# EAGLE schematic snowflake-hw-v1.0.1 R5 (EAGLE 9.2.2)
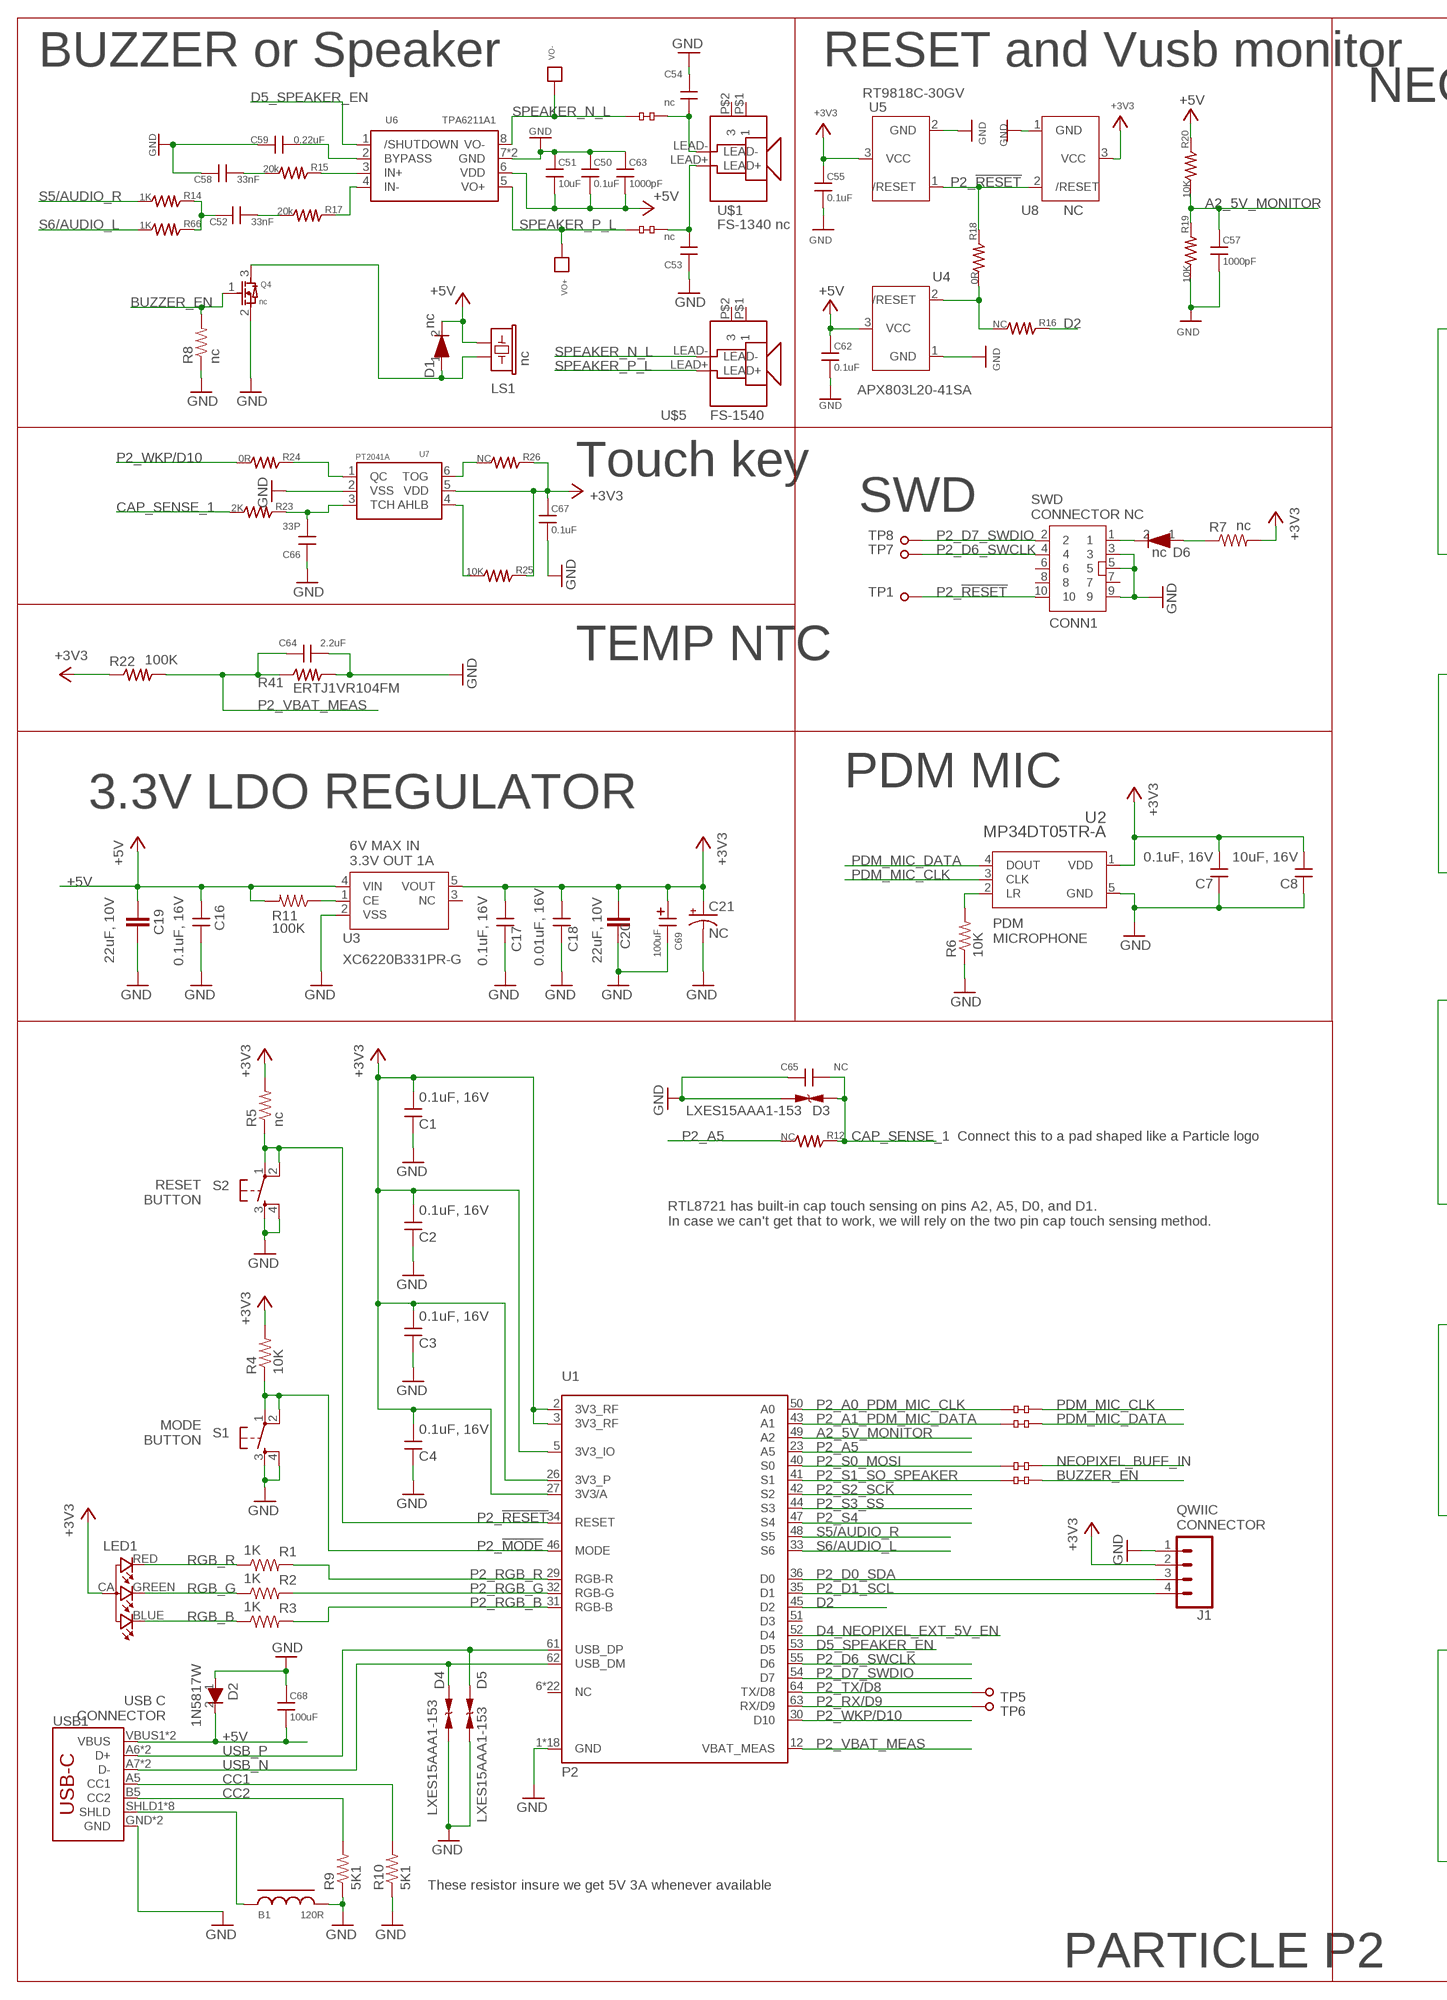
[diagram p0: schematic, sheet 1, part 1 of 2]
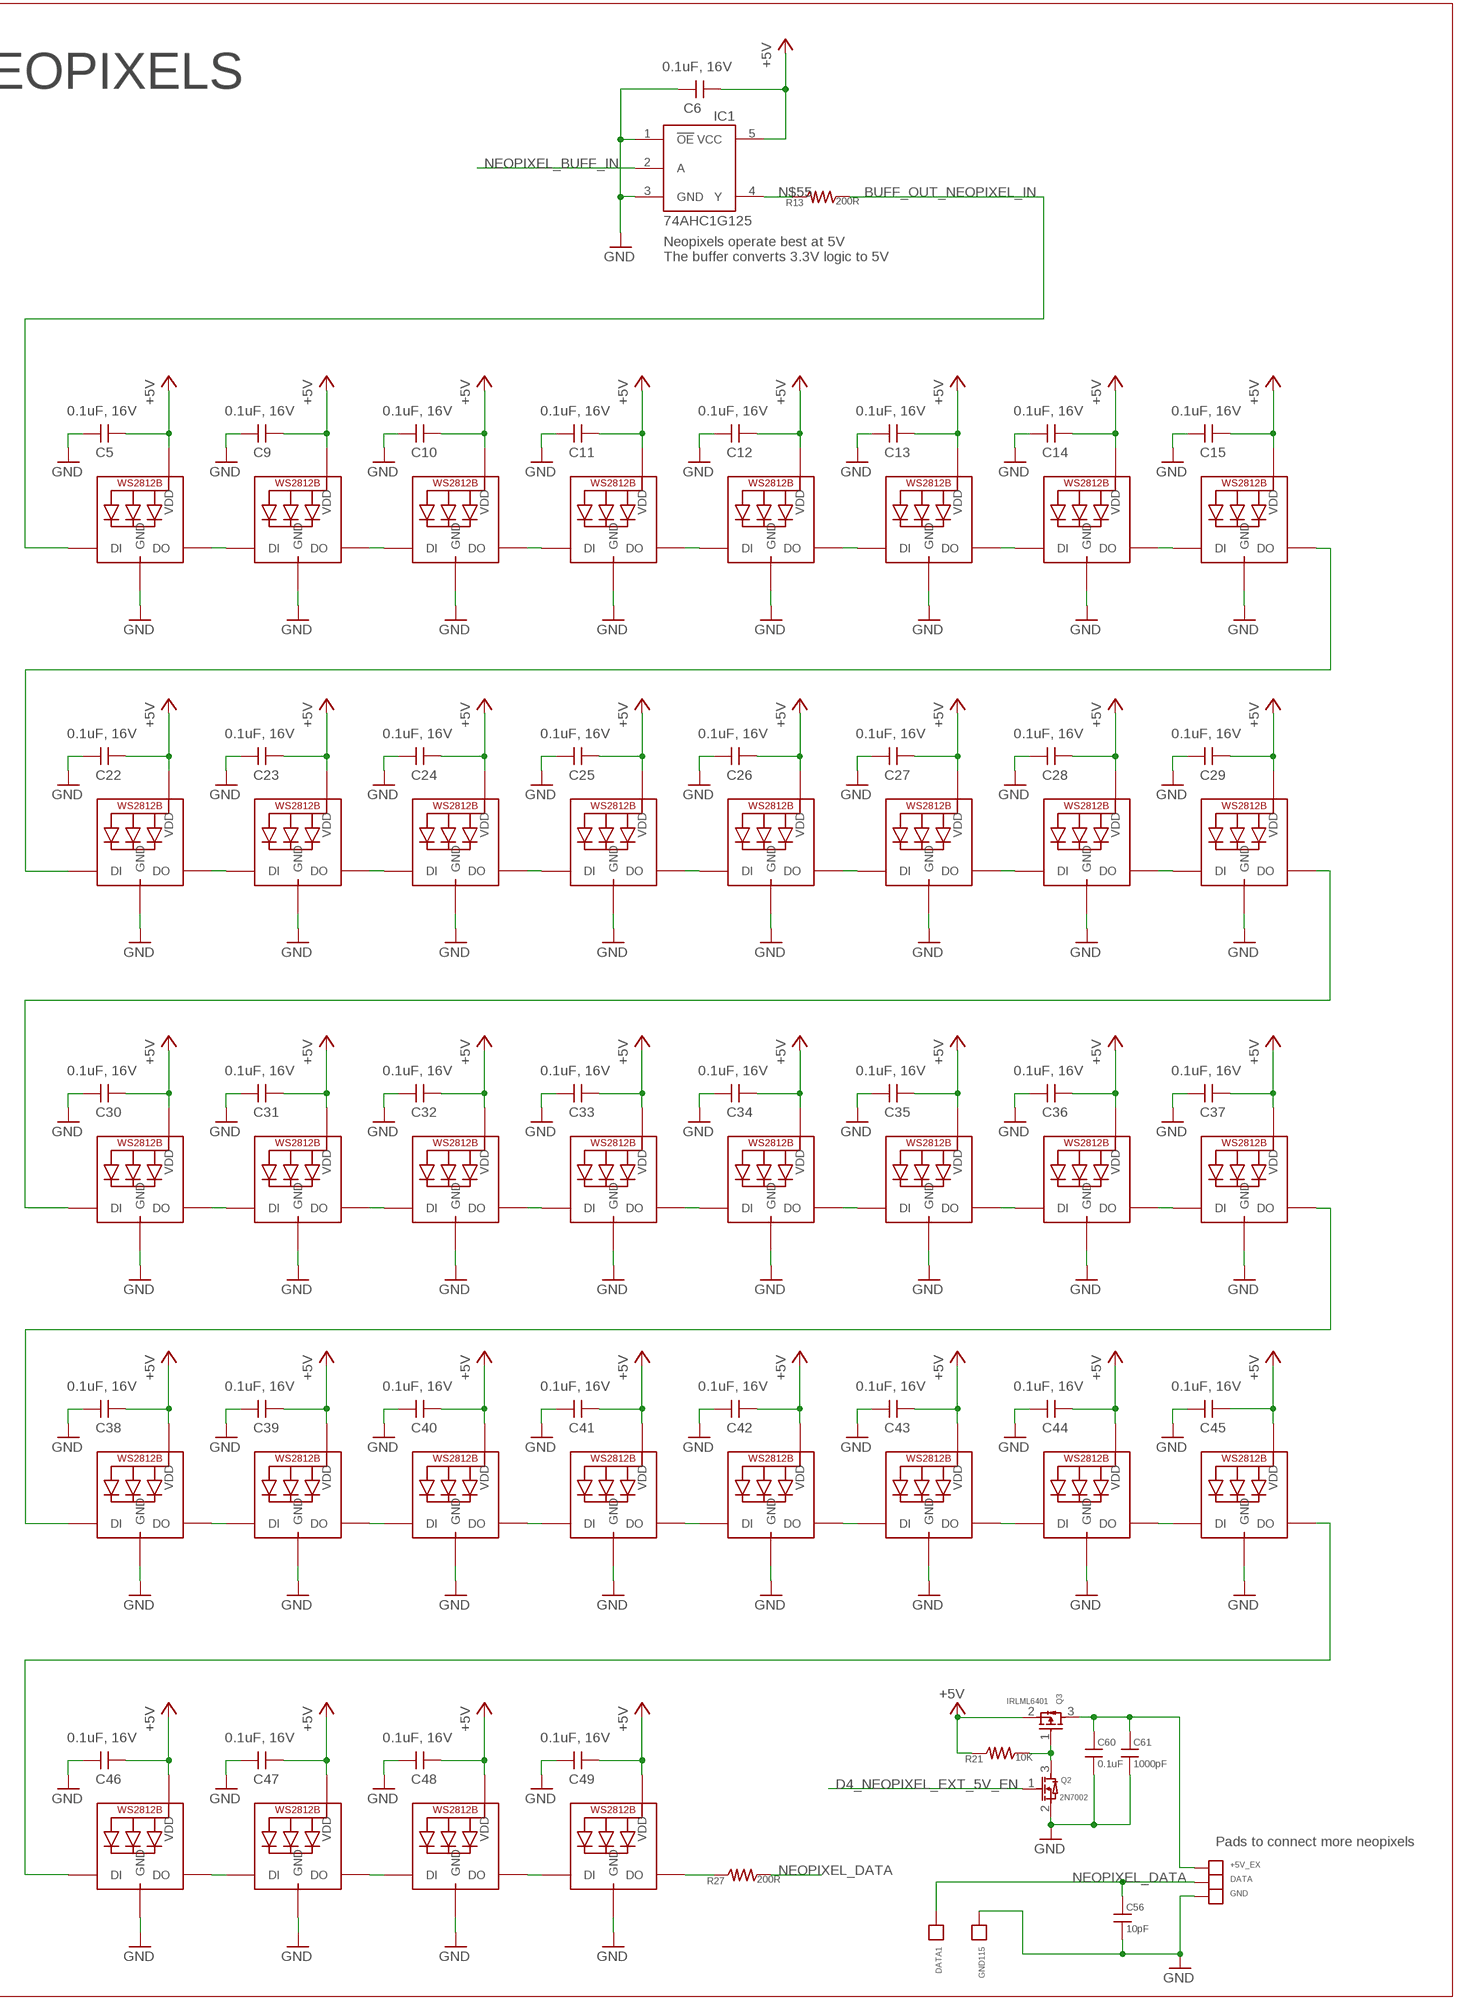
[diagram p1: schematic, sheet 1, part 2 of 2]

## Parts
+5V_EX  TP2X5MM  [TP_2X5MM]
B1  120R  L  [R-0603A]
C1  0.1uF, 16V  CAP_0.1UF_16V_0603  [C0603_P]
C2  0.1uF, 16V  CAP_0.1UF_16V_0603  [C0603_P]
C3  0.1uF, 16V  CAP_0.1UF_16V_0603  [C0603_P]
C4  0.1uF, 16V  CAP_0.1UF_16V_0603  [C0603_P]
C5  0.1uF, 16V  CAP_0.1UF_16V_0603  [C0603_P]
C6  0.1uF, 16V  CAP_0.1UF_16V_0603  [C0603_P]
C7  0.1uF, 16V  CAP_0.1UF_16V_0603  [C0603_P]
C8  10uF, 16V  CAP_10UF_16V_0603  [C0603_P]
C9  0.1uF, 16V  CAP_0.1UF_16V_0603  [C0603_P]
C10  0.1uF, 16V  CAP_0.1UF_16V_0603  [C0603_P]
C11  0.1uF, 16V  CAP_0.1UF_16V_0603  [C0603_P]
C12  0.1uF, 16V  CAP_0.1UF_16V_0603  [C0603_P]
C13  0.1uF, 16V  CAP_0.1UF_16V_0603  [C0603_P]
C14  0.1uF, 16V  CAP_0.1UF_16V_0603  [C0603_P]
C15  0.1uF, 16V  CAP_0.1UF_16V_0603  [C0603_P]
C16  0.1uF, 16V  CAP_0.1UF_16V_0603  [C0603_P]
C17  0.1uF, 16V  CAP_0.1UF_16V_0603  [C0603_P]
C18  0.01uF, 16V  CAP_0.01UF_25V_0603  [C0603_P]
C19  22uF, 10V  C-EUC0805  [C0805]
C20  22uF, 10V  C-EUC0805  [C0805]
C21  NC  CPOL-USC  [PANASONIC_C]
C22  0.1uF, 16V  CAP_0.1UF_16V_0603  [C0603_P]
C23  0.1uF, 16V  CAP_0.1UF_16V_0603  [C0603_P]
C24  0.1uF, 16V  CAP_0.1UF_16V_0603  [C0603_P]
C25  0.1uF, 16V  CAP_0.1UF_16V_0603  [C0603_P]
C26  0.1uF, 16V  CAP_0.1UF_16V_0603  [C0603_P]
C27  0.1uF, 16V  CAP_0.1UF_16V_0603  [C0603_P]
C28  0.1uF, 16V  CAP_0.1UF_16V_0603  [C0603_P]
C29  0.1uF, 16V  CAP_0.1UF_16V_0603  [C0603_P]
C30  0.1uF, 16V  CAP_0.1UF_16V_0603  [C0603_P]
C31  0.1uF, 16V  CAP_0.1UF_16V_0603  [C0603_P]
C32  0.1uF, 16V  CAP_0.1UF_16V_0603  [C0603_P]
C33  0.1uF, 16V  CAP_0.1UF_16V_0603  [C0603_P]
C34  0.1uF, 16V  CAP_0.1UF_16V_0603  [C0603_P]
C35  0.1uF, 16V  CAP_0.1UF_16V_0603  [C0603_P]
C36  0.1uF, 16V  CAP_0.1UF_16V_0603  [C0603_P]
C37  0.1uF, 16V  CAP_0.1UF_16V_0603  [C0603_P]
C38  0.1uF, 16V  CAP_0.1UF_16V_0603  [C0603_P]
C39  0.1uF, 16V  CAP_0.1UF_16V_0603  [C0603_P]
C40  0.1uF, 16V  CAP_0.1UF_16V_0603  [C0603_P]
C41  0.1uF, 16V  CAP_0.1UF_16V_0603  [C0603_P]
C42  0.1uF, 16V  CAP_0.1UF_16V_0603  [C0603_P]
C43  0.1uF, 16V  CAP_0.1UF_16V_0603  [C0603_P]
C44  0.1uF, 16V  CAP_0.1UF_16V_0603  [C0603_P]
C45  0.1uF, 16V  CAP_0.1UF_16V_0603  [C0603_P]
C46  0.1uF, 16V  CAP_0.1UF_16V_0603  [C0603_P]
C47  0.1uF, 16V  CAP_0.1UF_16V_0603  [C0603_P]
C48  0.1uF, 16V  CAP_0.1UF_16V_0603  [C0603_P]
C49  0.1uF, 16V  CAP_0.1UF_16V_0603  [C0603_P]
C50  0.1uF  CAPC0603  [C0603]
C51  10uF  CAP0603A  [C-0603A]
C52  33nF  CAP0402A  [C0402]
C53  nc  CAP0402  [C-0402]
C54  nc  CAP0402  [C-0402]
C55  0.1uF  CAP0603A  [C-0603A]
C56  10pF  CAP0402  [C-0402]
C57  1000pF  CAP0402  [C-0402]
C58  33nF  CAP0402A  [C0402]
C59  0.22uF  CAP0402  [C-0402]
C60  0.1uF  CAP0402  [C-0402]
C61  1000pF  CAP0402  [C-0402]
C62  0.1uF  CAP0603A  [C-0603A]
C63  1000pF  CAP0402  [C-0402]
C64  2.2uF  CAP0402  [C-0402]
C65  NC  CAP0402  [C-0402]
C66  33P  CAP0402  [C-0402]
C67  0.1uF  CAP0402  [C-0402]
C68  100uF  CAPC1206  [C1206]
C69  100uF  CAP-ECASE_B  [CASE-B]
CONN1  CONN5X2 nc  CONN5X2  [CONN5X2_1.27]
D1  nc  DIODESOD323  [SOD-323]
D2  1N5817W  DIODESOD123  [SOD-123]
D3  LXES15AAA1-153  ESD  [C0402]
D4  LXES15AAA1-153  ESD  [C0402]
D5  LXES15AAA1-153  ESD  [C0402]
D6  nc  DIODESOD323  [SOD-323]
DATA  TP2X5MM  [TP_2X5MM]
DATA1  TP2X5MM  [TP_2X5MM]
GND  TP2X5MM  [TP_2X5MM]
GND115  TP2X5MM  [TP_2X5MM]
IC1  74AHC1G125  [SOT23-5L]
J1  CONN_04SMD4  [JST04_1MM_VERT]
LED1  RGB-LED-CLMVB-FKARGB  [PLCC4-2MM-RGB]
LED2  WS2812B_SK6812E  [NEO3535_REVERSE]
LED3  WS2812B_SK6812E  [NEO3535_REVERSE]
LED4  WS2812B_SK6812E  [NEO3535_REVERSE]
LED5  WS2812B_SK6812E  [NEO3535_REVERSE]
LED6  WS2812B_SK6812E  [NEO3535_REVERSE]
LED7  WS2812B_SK6812E  [NEO3535_REVERSE]
LED8  WS2812B_SK6812E  [NEO3535_REVERSE]
LED9  WS2812B_SK6812E  [NEO3535_REVERSE]
LED10  WS2812B_SK6812E  [NEO3535_REVERSE]
LED11  WS2812B_SK6812E  [NEO3535_REVERSE]
LED12  WS2812B_SK6812E  [NEO3535_REVERSE]
LED13  WS2812B_SK6812E  [NEO3535_REVERSE]
LED14  WS2812B_SK6812E  [NEO3535_REVERSE]
LED15  WS2812B_SK6812E  [NEO3535_REVERSE]
LED16  WS2812B_SK6812E  [NEO3535_REVERSE]
LED17  WS2812B_SK6812E  [NEO3535_REVERSE]
LED18  WS2812B_SK6812E  [NEO3535_REVERSE]
LED19  WS2812B_SK6812E  [NEO3535_REVERSE]
LED20  WS2812B_SK6812E  [NEO3535_REVERSE]
LED21  WS2812B_SK6812E  [NEO3535_REVERSE]
LED22  WS2812B_SK6812E  [NEO3535_REVERSE]
LED23  WS2812B_SK6812E  [NEO3535_REVERSE]
LED24  WS2812B_SK6812E  [NEO3535_REVERSE]
LED25  WS2812B_SK6812E  [NEO3535_REVERSE]
LED26  WS2812B_SK6812E  [NEO3535_REVERSE]
LED27  WS2812B_SK6812E  [NEO3535_REVERSE]
LED28  WS2812B_SK6812E  [NEO3535_REVERSE]
LED29  WS2812B_SK6812E  [NEO3535_REVERSE]
LED30  WS2812B_SK6812E  [NEO3535_REVERSE]
LED31  WS2812B_SK6812E  [NEO3535_REVERSE]
LED32  WS2812B_SK6812E  [NEO3535_REVERSE]
LED33  WS2812B_SK6812E  [NEO3535_REVERSE]
LED34  WS2812B_SK6812E  [NEO3535_REVERSE]
LED35  WS2812B_SK6812E  [NEO3535_REVERSE]
LED36  WS2812B_SK6812E  [NEO3535_REVERSE]
LED37  WS2812B_SK6812E  [NEO3535_REVERSE]
LS1  nc  BUZZER-SMD  [BUZZER-CCV]
Q2  2N7002  NMOSSOT323  [SOT323]
Q3  IRLML6401  PMOS  [SOT-23]
Q4  nc  NMOSSOT-23  [SOT-23]
R1  1K  RES_1K_0402  [R0402_P]
R2  1K  RES_1K_0402  [R0402_P]
R3  1K  RES_1K_0402  [R0402_P]
R4  10K  RES_10K_0603  [R0603_P]
R5  nc  RES_10K_0603  [R0603_P]
R6  10K  RES_10K_0603  [R0603_P]
R7  nc  RES_1K_0603  [R0603_P]
R8  nc  RES_100K_0603  [R0603_P]
R9  5K1  RES_0603  [R0603_P]
R10  5K1  RES_0603  [R0603_P]
R11  100K  RES_100K_0603  [R0603_P]
R12  NC  RES0402S  [R-0402S]
R13  200R  RES0402S  [R-0402S]
R14  1K  RES0402S  [R-0402S]
R15  20k  RES0402S  [R-0402S]
R16  NC  RES0402S  [R-0402S]
R17  20k  RES0402S  [R-0402S]
R18  0R  RES0402S  [R-0402S]
R19  10K  RES0402S  [R-0402S]
R20  10K  RES0402S  [R-0402S]
R21  10K  RES0402S  [R-0402S]
R22  100K  RES0402S  [R-0402S]
R23  2K  RES0402S  [R-0402S]
R24  0R  RES0402S  [R-0402S]
R25  10K  RES0402S  [R-0402S]
R26  NC  RES0402S  [R-0402S]
R27  200R  RES0402S  [R-0402S]
R41  ERTJ1VR104FM  RESR0603A  [R-0603A]
R66  1K  RES0402S  [R-0402S]
S1  TAC_SWITCHSMD  [TACTILE_SWITCH_SMD]
S2  TAC_SWITCHSMD  [TACTILE_SWITCH_SMD]
TP1  TP-1.5MM  [TP]
TP5  TP-1.5MM  [TP]
TP6  TP-1.5MM  [TP]
TP7  TP-1.5MM  [TP]
TP8  TP-1.5MM  [TP]
U1  P2  [P2]
U2  MP34DT05TR-A  [MP34DT05TR-A_STM]
U3  XC6220B331PR-G  XC6220B331PR-GSOT-89-5_TOR-M  [SOT-89-5_TOR-M]
U4  APX803L20-41SA  APX803XXX-XXSASOT-23  [SOT-23]
U5  RT9818C-30GV  RT9818C  [SOT-23]
U6  TPA6211A1  [MSOP-8]
U7  PT2041A  [SOT-23-6]
U8  NC  APX803XXX-XXSASOT-23  [SOT-23]
U$1  NC  SEPAKER  [KJL-01304T(13X13MM)]
U$2  JMP_0603_NC  [JMP_0603_NC]
U$3  JMP_0603_NC  [JMP_0603_NC]
U$4  JMP_0603_NC  [JMP_0603_NC]
U$5  FS-1540  SEPAKER15X15MM  [KLJ-01504T]
U$6  JMP_0603_NC  [JMP_0603_NC]
U$7  JMP_0603_NC  [JMP_0603_NC]
U$15  JMP_0603_NC  [JMP_0603_NC]
USB1  USB_C16PIN  [USB-C-16P]
VO+  TP1.0X1.5  [TP-1.0X1.5]
VO-  TP1.0X1.5  [TP-1.0X1.5]

## Nets
+3V3: C1.1 C2.1 C3.1 C4.1 C7.1 C8.1 C17.2 C18.1 C20.1 C21.+ C55.2 C67.2 C69.P$1 J1.2 LED1.CA R4.2 R5.2 R7.2 R22.1 R25.2 R26.2 U1.2(3V3_RF) U1.3(3V3_RF) U1.5(3V3_IO) U1.26(3V3_P) U1.27(3V3/A) U2.1(VDD) U3.5(VOUT) U5.3(VCC) U7.5(VDD) U8.3(VCC)
+5V: C5.2 C6.2 C9.2 C10.2 C11.2 C12.2 C13.2 C14.2 C15.2 C16.2 C19.1 C22.2 C23.2 C24.2 C25.2 C26.2 C27.2 C28.2 C29.2 C30.2 C31.2 C32.2 C33.2 C34.2 C35.2 C36.2 C37.2 C38.2 C39.2 C40.2 C41.2 C42.2 C43.2 C44.2 C45.2 C46.2 C47.2 C48.2 C49.2 C50.1 C51.1 C62.2 C63.1 C68.1 D1.2 D2.2 IC1.5(VCC) LED2.1-VDD(VDD) LED3.1-VDD(VDD) LED4.1-VDD(VDD) LED5.1-VDD(VDD) LED6.1-VDD(VDD) LED7.1-VDD(VDD) LED8.1-VDD(VDD) LED9.1-VDD(VDD) LED10.1-VDD(VDD) LED11.1-VDD(VDD) LED12.1-VDD(VDD) LED13.1-VDD(VDD) LED14.1-VDD(VDD) LED15.1-VDD(VDD) LED16.1-VDD(VDD) LED17.1-VDD(VDD) LED18.1-VDD(VDD) LED19.1-VDD(VDD) LED20.1-VDD(VDD) LED21.1-VDD(VDD) LED22.1-VDD(VDD) LED23.1-VDD(VDD) LED24.1-VDD(VDD) LED25.1-VDD(VDD) LED26.1-VDD(VDD) LED27.1-VDD(VDD) LED28.1-VDD(VDD) LED29.1-VDD(VDD) LED30.1-VDD(VDD) LED31.1-VDD(VDD) LED32.1-VDD(VDD) LED33.1-VDD(VDD) LED34.1-VDD(VDD) LED35.1-VDD(VDD) LED36.1-VDD(VDD) LED37.1-VDD(VDD) LS1.+ Q3.2 R11.2 R20.2 R21.2 U3.4(VIN) U4.3(VCC) U6.6(VDD) USB1.VBUS1(VBUS) USB1.VBUS2(VBUS)
A2_5V_MONITOR: C57.2 R19.2 R20.1 U1.49(A2)
BUFF_OUT_NEOPIXEL_IN: LED2.4-DIN(DI) R13.1
BUZZER_EN: Q4.1 R8.2 U$2.2
CAP_SENSE_1: C65.1 D3.1 R12.2 R23.1
CC1: R10.2 USB1.A5(CC1)
CC2: R9.2 USB1.B5(CC2)
D2: R16.2 U1.45(D2)
D4_NEOPIXEL_EXT_5V_EN: Q2.1 U1.52(D4)
D5_SPEAKER_EN: U1.53(D5) U6.1(/SHUTDOWN)
GND: B1.2 C1.2 C2.2 C3.2 C4.2 C5.1 C6.1 C7.2 C8.2 C9.1 C10.1 C11.1 C12.1 C13.1 C14.1 C15.1 C16.1 C17.1 C18.2 C19.2 C20.2 C21.- C22.1 C23.1 C24.1 C25.1 C26.1 C27.1 C28.1 C29.1 C30.1 C31.1 C32.1 C33.1 C34.1 C35.1 C36.1 C37.1 C38.1 C39.1 C40.1 C41.1 C42.1 C43.1 C44.1 C45.1 C46.1 C47.1 C48.1 C49.1 C50.2 C51.2 C53.1 C54.2 C55.1 C56.1 C57.1 C58.2 C59.2 C60.1 C61.1 C62.1 C63.2 C64.1 C65.2 C66.1 C67.1 C68.2 C69.P$2 CONN1.3 CONN1.5 CONN1.9 D2.1 D3.2 D4.2 D5.2 GND115.P$1 GND.P$1 IC1.1(!OE) IC1.3(GND) J1.1 LED2.3-GND(GND) LED3.3-GND(GND) LED4.3-GND(GND) LED5.3-GND(GND) LED6.3-GND(GND) LED7.3-GND(GND) LED8.3-GND(GND) LED9.3-GND(GND) LED10.3-GND(GND) LED11.3-GND(GND) LED12.3-GND(GND) LED13.3-GND(GND) LED14.3-GND(GND) LED15.3-GND(GND) LED16.3-GND(GND) LED17.3-GND(GND) LED18.3-GND(GND) LED19.3-GND(GND) LED20.3-GND(GND) LED21.3-GND(GND) LED22.3-GND(GND) LED23.3-GND(GND) LED24.3-GND(GND) LED25.3-GND(GND) LED26.3-GND(GND) LED27.3-GND(GND) LED28.3-GND(GND) LED29.3-GND(GND) LED30.3-GND(GND) LED31.3-GND(GND) LED32.3-GND(GND) LED33.3-GND(GND) LED34.3-GND(GND) LED35.3-GND(GND) LED36.3-GND(GND) LED37.3-GND(GND) Q2.2 Q4.2 R6.1 R8.1 R9.1 R10.1 R19.1 R41.2 S1.3 S1.4 S2.3 S2.4 U1.1(GND) U1.4(GND) U1.13(GND) U1.15(GND) U1.25(GND) U1.28(GND) U1.37(GND) U1.39(GND) U1.59(GND) U1.65(GND) U1.66(GND) U1.67(GND) U1.68(GND) U1.69(GND) U1.70(GND) U1.71(GND) U1.72(GND) U1.73(GND) U2.5(GND) U3.2(VSS) U4.1(GND) U5.2(GND) U6.7(GND) U6.9(GND) U7.2(VSS) U8.1(GND) USB1.GND USB1.GND2(GND)
N$1: R6.2 U2.2(LR)
N$2: LED2.2-DOUT(DO) LED3.4-DIN(DI)
N$3: LED3.2-DOUT(DO) LED4.4-DIN(DI)
N$4: LED4.2-DOUT(DO) LED5.4-DIN(DI)
N$5: LED5.2-DOUT(DO) LED6.4-DIN(DI)
N$6: LED6.2-DOUT(DO) LED7.4-DIN(DI)
N$7: LED7.2-DOUT(DO) LED8.4-DIN(DI)
N$8: LED8.2-DOUT(DO) LED9.4-DIN(DI)
N$9: D1.1 LS1.- Q4.3
N$10: R11.1 U3.1(CE)
N$11: LED10.2-DOUT(DO) LED11.4-DIN(DI)
N$12: LED11.2-DOUT(DO) LED12.4-DIN(DI)
N$13: LED12.2-DOUT(DO) LED13.4-DIN(DI)
N$14: LED13.2-DOUT(DO) LED14.4-DIN(DI)
N$15: LED14.2-DOUT(DO) LED15.4-DIN(DI)
N$16: LED15.2-DOUT(DO) LED16.4-DIN(DI)
N$17: CONN1.1 D6.2
N$18: D6.1 R7.1
N$19: LED16.2-DOUT(DO) LED17.4-DIN(DI)
N$20: LED9.2-DOUT(DO) LED10.4-DIN(DI)
N$21: LED24.2-DOUT(DO) LED25.4-DIN(DI)
N$22: LED23.2-DOUT(DO) LED24.4-DIN(DI)
N$23: LED22.2-DOUT(DO) LED23.4-DIN(DI)
N$24: LED21.2-DOUT(DO) LED22.4-DIN(DI)
N$25: LED20.2-DOUT(DO) LED21.4-DIN(DI)
N$26: LED19.2-DOUT(DO) LED20.4-DIN(DI)
N$27: LED18.2-DOUT(DO) LED19.4-DIN(DI)
N$28: LED25.2-DOUT(DO) LED26.4-DIN(DI)
N$29: LED26.2-DOUT(DO) LED27.4-DIN(DI)
N$30: LED27.2-DOUT(DO) LED28.4-DIN(DI)
N$31: LED28.2-DOUT(DO) LED29.4-DIN(DI)
N$32: LED29.2-DOUT(DO) LED30.4-DIN(DI)
N$33: LED30.2-DOUT(DO) LED31.4-DIN(DI)
N$34: LED31.2-DOUT(DO) LED32.4-DIN(DI)
N$35: LED32.2-DOUT(DO) LED33.4-DIN(DI)
N$36: LED17.2-DOUT(DO) LED18.4-DIN(DI)
N$37: LED34.2-DOUT(DO) LED35.4-DIN(DI)
N$38: LED35.2-DOUT(DO) LED36.4-DIN(DI)
N$39: LED36.2-DOUT(DO) LED37.4-DIN(DI)
N$40: LED33.2-DOUT(DO) LED34.4-DIN(DI)
N$41: C52.1 R17.1
N$42: R17.2 U6.4(IN-)
N$43: R16.1 R18.1 U4.2(/RESET)
N$44: Q2.3 Q3.1 R21.1
N$45: +5V_EX.P$1 C60.2 C61.2 Q3.3
N$46: C58.1 R15.1
N$47: R15.2 U6.3(IN+)
N$48: C52.2 R14.2 R66.2
N$49: C59.1 U6.2(BYPASS)
N$50: C66.2 R23.2 U7.3(TCH)
N$51: R24.2 U7.1(QC)
N$52: R25.1 U7.4(AHLB)
N$53: B1.1 USB1.SHLD1(SHLD) USB1.SHLD2(SHLD) USB1.SHLD3(SHLD) USB1.SHLD4(SHLD) USB1.SHLD5(SHLD) USB1.SHLD6(SHLD) USB1.SHLD7(SHLD) USB1.SHLD8(SHLD)
N$54: R26.1 U7.6(TOG)
N$55: IC1.4(Y) R13.2
N$56: LED37.2-DOUT(DO) R27.2
NEOPIXEL_BUFF_IN: IC1.2(A) U$15.2
NEOPIXEL_DATA: C56.2 DATA1.P$1 DATA.P$1 R27.1
P2_!MODE: R4.1 S1.1 S1.2 U1.46(MODE)
P2_!RESET: CONN1.10 R5.1 R18.2 S2.1 S2.2 TP1.TP U1.34(RESET) U5.1(/RESET) U8.2(/RESET)
P2_A0_PDM_MIC_CLK: U1.50(A0) U$4.1
P2_A1_PDM_MIC_DATA: U1.43(A1) U$3.1
P2_A5: R12.1 U1.23(A5)
P2_D0_SDA: J1.3 U1.36(D0)
P2_D1_SCL: J1.4 U1.35(D1)
P2_D6_SWCLK: CONN1.4 TP7.TP U1.55(D6)
P2_D7_SWDIO: CONN1.2 TP8.TP U1.54(D7)
P2_RGB_B: R3.2 U1.31(RGB-B)
P2_RGB_G: R2.2 U1.32(RGB-G)
P2_RGB_R: R1.2 U1.29(RGB-R)
P2_RX/D9: TP6.TP U1.63(RX/D9)
P2_S0_MOSI: U1.40(S0) U$15.1
P2_S1_SO_SPEAKER: U1.41(S1) U$2.1
P2_S2_SCK: U1.42(S2)
P2_S3_SS: U1.44(S3)
P2_S4: U1.47(S4)
P2_TX/D8: TP5.TP U1.64(TX/D8)
P2_VBAT_MEAS: C64.2 R22.2 R41.1 U1.12(VBAT_MEAS)
P2_WKP/D10: R24.1 U1.30(D10)
PDM_MIC_CLK: U2.3(CLK) U$4.2
PDM_MIC_DATA: U2.4(DOUT) U$3.2
RGB_B: LED1.BLUE R3.1
RGB_G: LED1.GREEN R2.1
RGB_R: LED1.RED R1.1
S5/AUDIO_R: R14.1 U1.48(S5)
S6/AUDIO_L: R66.1 U1.33(S6)
SPEAKER_N_L: C54.1 U6.8(VO-) U$1.LEAD- U$5.LEAD- U$6.1 U$6.2 VO-.P$1
SPEAKER_P_L: C53.2 U6.5(VO+) U$1.LEAD+ U$5.LEAD+ U$7.1 U$7.2 VO+.P$1
USB_N [usb]: D4.1 U1.62(USB_DM) USB1.A7(D-) USB1.B7(D-)
USB_P [usb]: D5.1 U1.61(USB_DP) USB1.A6(D+) USB1.B6(D+)
Unconnected: CONN1.6 CONN1.7 CONN1.8 U1.6(NC) U1.7(NC) U1.8(NC) U1.9(NC) U1.10(NC) U1.11(NC) U1.14(NC) U1.16(NC) U1.17(NC) U1.18(NC) U1.19(NC) U1.20(NC) U1.21(NC) U1.22(NC) U1.24(NC) U1.38(NC) U1.51(D3) U1.56(NC) U1.57(NC) U1.58(NC) U1.60(NC) U1.74(NC) U1.75(NC) U3.3(NC) U$1.P$1 U$1.P$2 U$5.P$1 U$5.P$2

## Notes on the sheet
- BUZZER or Speaker | RESET and Vusb monitor
- NEOPIXELS
- U$1
- FS-1340 nc
- Neopixels operate best at 5V
  The buffer converts 3.3V logic to 5V
- U$5 | FS-1540
- Touch key
- SWD
- SWD
  CONNECTOR NC
- TEMP NTC
- PDM MIC
- 3.3V LDO REGULATOR
- 6V MAX IN
  3.3V OUT 1A
- PDM
  MICROPHONE
- Connect this to a pad shaped like a Particle logo
- RESET
  BUTTON
- RTL8721 has built-in cap touch sensing on pins A2, A5, D0, and D1. 
  In case we can't get that to work, we will rely on the two pin cap touch sensing method.
- MODE
  BUTTON
- QWIIC
  CONNECTOR
- USB C
  CONNECTOR
- Pads to connect more neopixels
- These resistor insure we get 5V 3A whenever available
- PARTICLE P2

## Library data of the parts
+5V_EX DATA DATA1 GND GND115 VO+ VO- = particle SZ:TP
B1 = particle SZ:L
C1-C7 C9-C17 C22-C49 = particle-studios:CAP_: Particle Capacitors; DESP: CAP CER 0.1UF 16V X7R 0603; MFG: FENGHUA; MPN: 0603B104K160NT; PPN: PT-200082
C8 = particle-studios:CAP_: Particle Capacitors; DESP: CAP CER 10UF 16V X7R 0603; MFG: FENGHUA; MPN: 0603X106M160NT; PPN: PT-200139
C18 = particle-studios:CAP_: Particle Capacitors; DESP: CAP CER 0.01UF 16V X7R 0603; MFG: YAGEO; MPN: CC0603KRX7R9BB103; PPN: PT-200456
C19 C20 = rcl:C-EU: CAPACITOR, European symbol; SPICEPREFIX: C
C21 = rcl:CPOL-US: POLARIZED CAPACITOR, American symbol; SPICEPREFIX: C
C50-C68 = particle SZ:CAP: CAP
C69 = particle SZ:CAP-E
CONN1 = particle-studios:CONN5X2: 5x2 pin JTAG connector for Particle mesh dev kits
D1 D2 D6 = particle SZ:DIODE: DIODE
D3-D5 = particle SZ:ESD
IC1 = adafruit:74AHC1G125
J1 = SparkFun-Connectors:CONN_04: Multi connection point. Often used as Generic Header-pin footprint for 0.1 inch spaced/style header connections On any of the 0.1 inch spaced packages, you can populate with these: Break Away Headers - Straight <https://www.sparkfun.com/products/116> (PRT-00116) Break Away Male Headers - Right Angle <https://www.sparkfun.com/products/553> (PRT-00553) Female Headers <https://www.sparkfun.com/products/115> (PRT-00115) Break Away Headers - Machine Pin <https://www.sparkfun.com/products/117> (PRT-00117) Break Away Female Headers - Swiss Machine Pin <https://www.sparkfun.com/products/743> (PRT-00743) For SCREWTERMINALS and SPRING TERMINALS visit here: Screw Terimnals on SparkFun.com <https://www.sparkfun.com/search/results?term=Screw+Terminals> (5mm/3.5mm/2.54mm spacing) This device is also useful as a general connection point to wire up your design to another part of your project. Our various solder wires solder well into these plated through hole pads. Hook-Up Wire - Assortment (Stranded, 22 AWG) <https://www.sparkfun.com/products/11375> (PRT-11375) Hook-Up Wire - Assortment (Solid Core, 22 AWG) <https://www.sparkfun.com/products/11367> (PRT-11367) View the entire wire category on our website here <https://www.sparkfun.com/categories/141> Special notes: Molex polarized connector foot print use with SKU : PRT-08231 with associated crimp pins and housings. 1MM SMD Version SKU: PRT-10208; COLOR: BLACK; PROD_ID: CONN-14483
LED1 = particle-studios:RGB-LED-CLMVB-FKA: CREE CLMVB-FKA RGB LED 2mm x 2mm
LED2-LED37 = microbuilder:WS2812B
LS1 = SparkFun-Electromechanical:BUZZER: Buzzer Small round buzzers that operate around the audible 2kHz range. You can use these as speakers to create simple music or user interfaces. Variant Overview: PTH - Mini Speaker - PC Mount 12mm 2.048kHz <https://www.sparkfun.com/products/7950> PTH_KIT - Mini Speaker - PC Mount 12mm 2.048kHz <https://www.sparkfun.com/products/7950> KIT simplifies soldering by adding stop mask to one side of the pads. PTH_NO_SILK - Mini Speaker - PC Mount 12mm 2.048kHz <https://www.sparkfun.com/products/7950> No silkscreen indicator of buzzer outline. PTH_KIT_NO_SILK - Mini Speaker - PC Mount 12mm 2.048kHz <https://www.sparkfun.com/products/7950> KIT package w/o silkscreen SMD - Buzzer Audio Magnetic (CCV-084B16) SMD buzzer used on, e.g. the LilyPad Buzzer <https://www.sparkfun.com/products/8463> and RFID USB Reader <https://www.sparkfun.com/products/9963>. SMD_KIT - Buzzer Audio Magnetic (CCV-084B16) SMD Buzzer with elongated pins to make soldering easier. Used on the SparkFun Simon Says - Surface Mount Soldering Kit <https://www.sparkfun.com/products/10935>.; PROD_ID: COMP-08568
Q2 Q4 = particle SZ:NMOS: NMOS
Q3 = particle SZ:PMOS: PMOS
R1-R3 = particle-studios:RES_: Particle Resistors; DESP: RES SMD 1K OHM 1% 1/10W 0603
R4 R6 = particle-studios:RES_: Particle Resistors; DESP: RES SMD 10K OHM 1% 1/10W 0603; MFG: YAGEO; MPN: RC0603FR-0710KL; PPN: PT-200477
R5 = particle-studios:RES_: Particle Resistors; DESP: RES SMD 10K OHM 1% 1/10W 0603; MFG: YAGEO; MPN: RC0603FR-0710KL; PPN: PT-200477; VALUE: 10K
R7 = particle-studios:RES_: Particle Resistors; DESP: RES SMD 1K OHM 1% 1/10W 0603; MFG: FENGHUA; MPN: RC-03K102FT; PPN: PT-200135; VALUE: 1K
R8 = particle-studios:RES_: Particle Resistors; DESP: RES SMD 100K OHM 1% 1/10W 0603; VALUE: 100K
R9 R10 = particle-studios:RES_: Particle Resistors
R11 = particle-studios:RES_: Particle Resistors; DESP: RES SMD 100K OHM 1% 1/10W 0603
R12-R27 R41 R66 = particle SZ:RES: RES
S1 S2 = particle-studios:TAC_SWITCH: SMD Tactiile Switch
TP1 TP5-TP8 = particle-studios:TP-1.5MM
U1 = particle-studios:P2: Particle P2
U2 = particle-studios:MP34DT05TR-A; COPYRIGHT: Copyright (C) 2023 Ultra Librarian. All rights reserved.; DIGIKEY_PART_NUMBER_1: MP34DT05TR-A-ND; DIGIKEY_PART_NUMBER_2: 497-17809-1-ND; DIGIKEY_PART_NUMBER_3: 497-17809-2-ND; DIGIKEY_PART_NUMBER_4: 497-17809-6-ND; MANUFACTURER_PART_NUMBER: MP34DT05TR-A; MFR_NAME: STMicroelectronics
U3 = particle-studios:XC6220B331PR-G; COPYRIGHT: Copyright (C) 2022 Ultra Librarian. All rights reserved.; DIGI-KEY_PART_NUMBER_1: 893-1128-1-ND; DIGI-KEY_PART_NUMBER_2: 893-1128-2-ND; DIGI-KEY_PART_NUMBER_3: 893-1128-2-NDL; DIGI-KEY_PART_NUMBER_4: 893-1128-6-ND; MANUFACTURER_PART_NUMBER: XC6220B331PR-G; MFR_NAME: Torex Semiconductor
U4 U8 = particle SZ:APX803XXX-XXSA
U5 = particle SZ:RT9818C
U6 = particle SZ:TPA6211A1
U7 = particle SZ:PT2041A
U$1 U$5 = particle SZ:SEPAKER
U$2-U$4 U$6 U$7 U$15 = particle-studios:JMP_0603_NC
USB1 = SparkFun-Connectors:USB_C: USB Type C 16Pin Connector Super Speed pins not available on the 16-pin purely SMD connector so this part is best for USB 2.0 implementations. D1 and D2 are tied together enabling D+/- no matter which way the cable is plugged into the connector. The two channel configuration pins (CC1/2) are exposed. These are normally connected to ground via 5.1k resistors but can be reconfigured for high current/high power applications.; PROD_ID: CONN-14122

## Net classes
0 default: width 0.152 mm, clearance 0.152 mm
1 usb: width 0.2 mm, clearance 0.2 mm to class 0, clearance 0.2 mm